# Altium schematic sheet LCD.SchDoc
size 420 x 297 mm; SheetNumber: 5; SheetTotal: 5
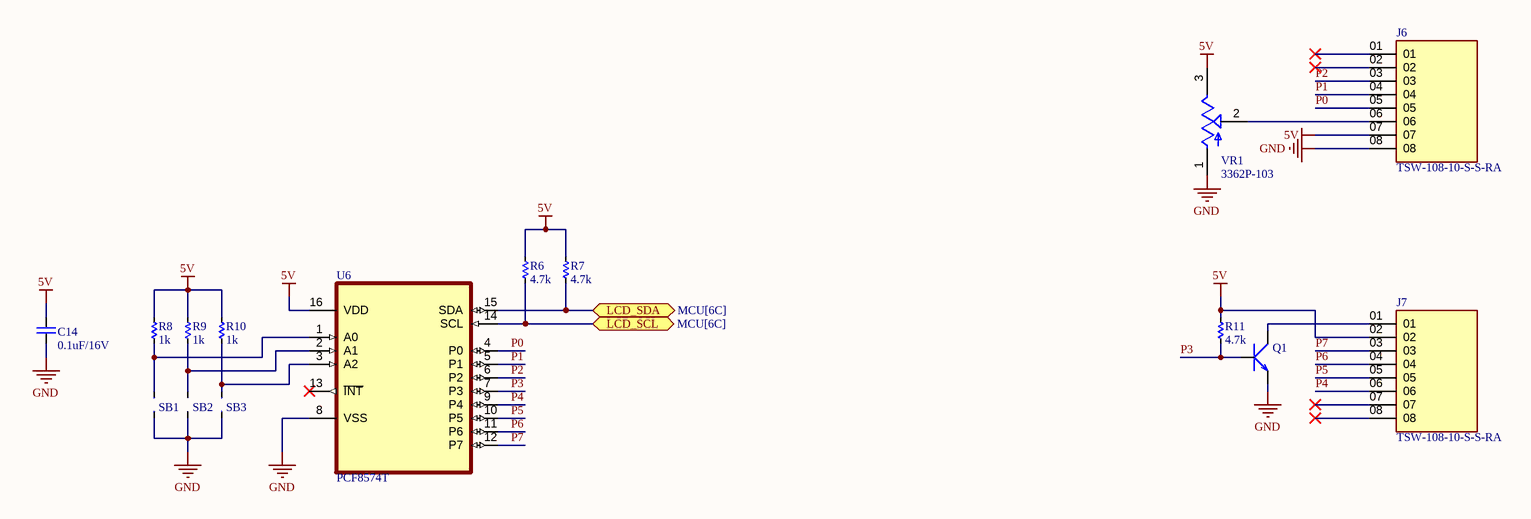
[diagram p0: LCD.SchDoc]

## Parts
C14  0.1uF/16V  [CAP_C_1608X80]
J6  TSW-108-10-S-S-RA  [SAMTEC_TSW-108-10-S-S-RA]
J7  TSW-108-10-S-S-RA  [SAMTEC_TSW-108-10-S-S-RA]
Q1  SMD-TRANSISTORS-NPN-25V-500MW(SOT-23)  [SOT-23]  (value not drawn)
R6  4.7k  [RES_C_1608X60]
R7  4.7k  [RES_C_1608X60]
R8  1k  [RES_C_1608X60]
R9  1k  [RES_C_1608X60]
R10  1k  [RES_C_1608X60]
R11  4.7k  [RES_C_1608X60]
SB1  JUMPER  [JUMPER_1608]  (value not drawn)
SB2  JUMPER  [JUMPER_1608]  (value not drawn)
SB3  JUMPER  [JUMPER_1608]  (value not drawn)
U6  PCF8574T  [SOIC127P1032X265-16N]
VR1  3362P-103  [TRIM_3362P-103]

## Ports
LCD_SCL (bidir, see MCU[6C]), LCD_SDA (bidir, see MCU[6C])

## Nets
5V: C14.2 J6.07 J7.02 R6.2 R7.2 R8.2 R9.2 R10.2 R11.2 U6.16(VDD) VR1.3(CW)
GND: C14.1 J6.08 Q1.2(E) SB1.1 SB2.1 SB3.1 U6.8(VSS) VR1.1(CCW)
LCD_SCL: R6.1 U6.14(SCL) ; port LCD_SCL
LCD_SDA: R7.1 U6.15(SDA) ; port LCD_SDA
P0: J6.05 U6.4(P0)
P1: J6.04 U6.5(P1)
P2: J6.03 U6.6(P2)
P3: Q1.1(B) R11.1 U6.7(P3)
P4: J7.06 U6.9(P4)
P5: J7.05 U6.10(P5)
P6: J7.04 U6.11(P6)
P7: J7.03 U6.12(P7)
NetJ6_06: J6.06 VR1.2(WIPER)
NetJ7_01: J7.01 Q1.3(C)
NetR8_1: R8.1 SB1.2 U6.1(A0)
NetR9_1: R9.1 SB2.2 U6.2(A1)
NetR10_1: R10.1 SB3.2 U6.3(A2)

Not connected (* = marked no-connect by the designer): J6 01* 02*; J7 07* 08*; U6 13(~{INT})*

## Notes on the sheet
- Sub-system:
- Project:
- Design by:
- Sheet title:
- Sheet
- of
- Checked by:
- Approved by:
- Doc No:
- Revision:
- Size:
- Date:
- A3

## Library data of the parts
C14 = CAP_SMD: CAP_Chip; Value: 33pF
J6 J7 = TSW-108-10-S-S-RA: Connector Header Through Hole, Right Angle 8 position 0.100 (2.54mm); MF: Samtec; SnapEDA_Link: https://www.snapeda.com/parts/TSW-108-10-S-S-RA/Samtec/view-part/?ref=snap; Package: None; Value: *; MP: TSW-108-10-S-S-RA; Check_prices: https://www.snapeda.com/parts/TSW-108-10-S-S-RA/Samtec/view-part/?ref=eda
Q1 = SMD-TRANSISTORS-NPN-25V-500MW(SOT-23): Bipolar (BJT) Transistor NPN 25 V 500 mA 150MHz 300 mW Surface Mount SOT-23; MF: UMW; MP: S8050; Purchase-URL: https://pricing.snapeda.com/search/part/S8050/?ref=eda; Check_prices: https://www.snapeda.com/parts/S8050/Umwelt+Sensor+Teknik/view-part/?ref=eda; SnapEDA_Link: https://www.snapeda.com/parts/S8050/Umwelt+Sensor+Teknik/view-part/?ref=snap; Price: None; Availability: In Stock; Package: None; Value: *
R6-R11 = RES_SMD: RES
U6 = PCF8574T: I/O Expander 8 IÂ²C 100 kHz 20-SSOP; MF: NXP Semiconductors; MP: PCF8574T; Price: None; Availability: In Stock; Package: SOIC-16 NXP Semiconductors; Purchase-URL: https://pricing.snapeda.com/search/part/PCF8574T/?ref=eda; SnapEDA_Link: https://www.snapeda.com/parts/PCF8574T/NXP+Semiconductors/view-part/?ref=snap; Value: *; Check_prices: https://www.snapeda.com/parts/PCF8574T/NXP+Semiconductors/view-part/?ref=eda
VR1 = 3362P-103: 10 kOhms 0.5W, 1/2W PC Pins Through Hole Trimmer Potentiometer Cermet 1 Turn Top Finger Adjustment; MF: Bourns; SnapEDA_Link: https://www.snapeda.com/parts/3362P-103/Bourns/view-part/?ref=snap; Package: 3362P-1 Bourns Inc.; Value: *; MP: 3362P-103; Check_prices: https://www.snapeda.com/parts/3362P-103/Bourns/view-part/?ref=eda